# EAGLE schematic pm2017 (EAGLE 8.1.1)

## Sheet 1 of 2
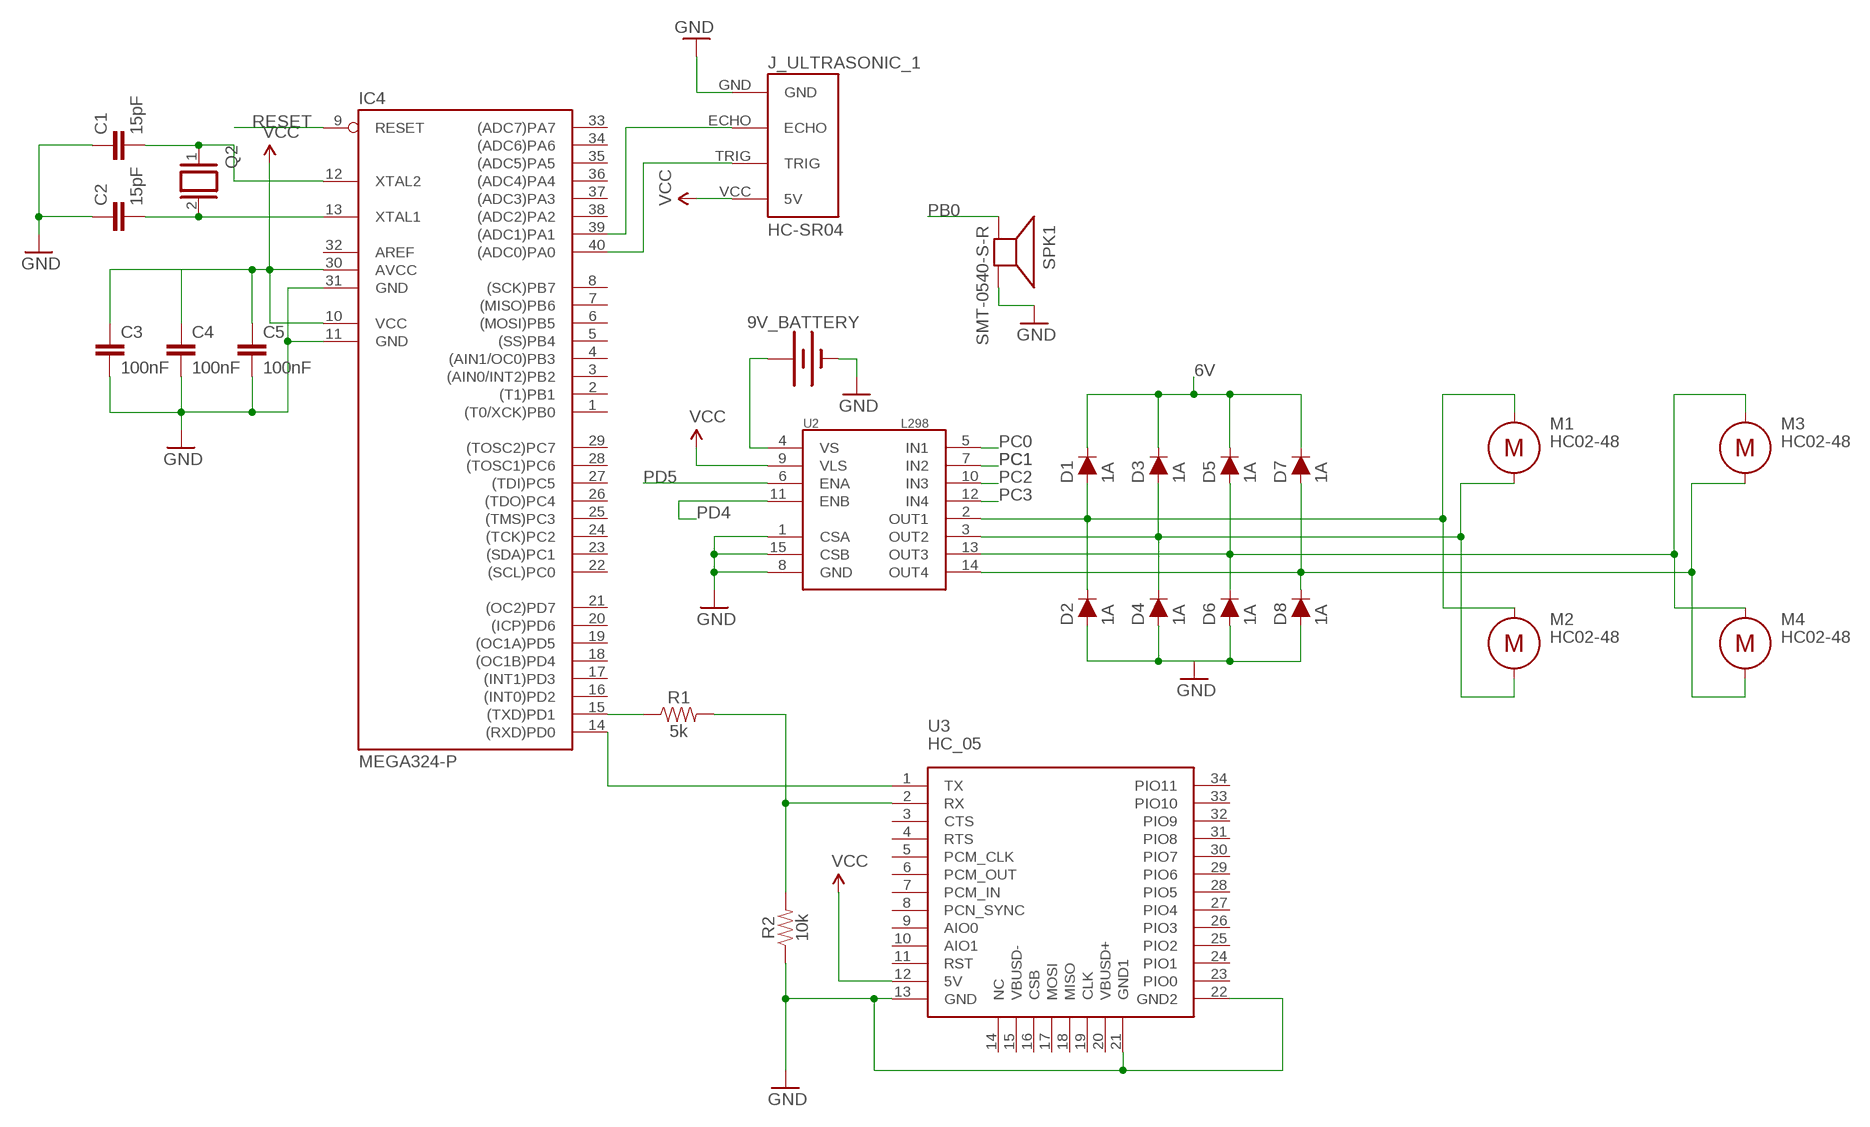
[diagram p0: schematic, sheet 1]

### Parts
9V_BATTERY  BATTERY-9V  [BATTCON_9V]
C1  15pF  C-EUC_PM  [C025-025X050]
C2  15pF  C-EUC_PM  [C025-025X050]
C3  100nF  C-EUC_PM  [C025-025X050]
C4  100nF  C-EUC_PM  [C025-025X050]
C5  100nF  C-EUC_PM  [C025-025X050]
D1  1A  DIODE-PTH  [DIODE-1N4001]
D2  1A  DIODE-PTH  [DIODE-1N4001]
D3  1A  DIODE-PTH  [DIODE-1N4001]
D4  1A  DIODE-PTH  [DIODE-1N4001]
D5  1A  DIODE-PTH  [DIODE-1N4001]
D6  1A  DIODE-PTH  [DIODE-1N4001]
D7  1A  DIODE-PTH  [DIODE-1N4001]
D8  1A  DIODE-PTH  [DIODE-1N4001]
IC4  MEGA324-P  MEGA16-P  [DIL40]
J_ULTRASONIC_1  HC-SR04  [HC-SR04_FOOTPRINT]
Q2  XTAL/S  [QS]
R1  5k  4.7KOHM-0603-1/10W-1%  [0603]
R2  10k  10KOHM-HORIZ-1/4W-1%  [AXIAL-0.3]
SPK1  SMT-0540-S-R  [SMT-0540-S-R]
U2  L298  [MULTIWATT15]
U3  HC_05  [BLUETOOTH_SMD]

### Nets
6V: D1.C D3.C D5.C D7.C
6V1: D1.A D2.C U2.2(OUT1)
GND: 9V_BATTERY.- C1.1 C2.1 C3.2 C4.2 C5.2 IC4.11(GND) IC4.31(GND) J_ULTRASONIC_1.GND R2.P$1 SPK1.+(-) U2.1(CSA) U2.8(GND) U2.15(CSB) U3.13(GND) U3.21(GND1) U3.22(GND2) ; also sheet 2
N$11: C3.1 IC4.30(AVCC)
N$12: C2.2 IC4.13(XTAL1) Q2.2
N$13: C1.2 IC4.12(XTAL2) Q2.1
N$16: IC4.40((ADC0)PA0) J_ULTRASONIC_1.TRIG
N$18: IC4.39((ADC1)PA1) J_ULTRASONIC_1.ECHO
N$24: D5.A D6.C U2.13(OUT3)
N$25: 9V_BATTERY.+ U2.4(VS)
N$26: D7.A D8.C U2.14(OUT4)
N$27: D3.A D4.C U2.3(OUT2)
N$28: IC4.14((RXD)PD0) U3.1(TX)
N$29: D2.A D4.A D6.A D8.A
N$30: IC4.15((TXD)PD1) R1.1
N$31: R1.2 R2.P$2 U3.2(RX)
PB0: SPK1.-(+)
PC0: U2.5(IN1) ; also sheet 2
PC1: U2.7(IN2) ; also sheet 2
PC2: U2.10(IN3)
PC3: U2.12(IN4)
PD4: U2.11(ENB)
PD5: U2.6(ENA)
RESET: IC4.9(RESET) ; also sheet 2
VCC: C4.1 C5.1 IC4.10(VCC) J_ULTRASONIC_1.VCC(5V) U2.9(VLS) U3.12(5V) ; also sheet 2
Unconnected: IC4.1((T0/XCK)PB0) IC4.2((T1)PB1) IC4.3((AIN0/INT2)PB2) IC4.4((AIN1/OC0)PB3) IC4.5((SS)PB4) IC4.6((MOSI)PB5) IC4.7((MISO)PB6) IC4.8((SCK)PB7) IC4.16((INT0)PD2) IC4.17((INT1)PD3) IC4.18((OC1B)PD4) IC4.19((OC1A)PD5) IC4.20((ICP)PD6) IC4.21((OC2)PD7) IC4.22((SCL)PC0) IC4.23((SDA)PC1) IC4.24((TCK)PC2) IC4.25((TMS)PC3) IC4.26((TDO)PC4) IC4.27((TDI)PC5) IC4.28((TOSC1)PC6) IC4.29((TOSC2)PC7) IC4.32(AREF) IC4.33((ADC7)PA7) IC4.34((ADC6)PA6) IC4.35((ADC5)PA5) IC4.36((ADC4)PA4) IC4.37((ADC3)PA3) IC4.38((ADC2)PA2) U3.3(CTS) U3.4(RTS) U3.5(PCM_CLK) U3.6(PCM_OUT) U3.7(PCM_IN) U3.8(PCN_SYNC) U3.9(AIO0) U3.10(AIO1) U3.11(RST) U3.14(NC) U3.15(VBUSD-) U3.16(CSB) U3.17(MOSI) U3.18(MISO) U3.19(CLK) U3.20(VBUSD+) U3.23(PIO0) U3.24(PIO1) U3.25(PIO2) U3.26(PIO3) U3.27(PIO4) U3.28(PIO5) U3.29(PIO6) U3.30(PIO7) U3.31(PIO8) U3.32(PIO9) U3.33(PIO10) U3.34(PIO11)

### Notes on the sheet
- M1 | M3
- M | HC02-48 | M | HC02-48
- M2 | M4
- M | HC02-48 | M | HC02-48

## Sheet 2 of 2
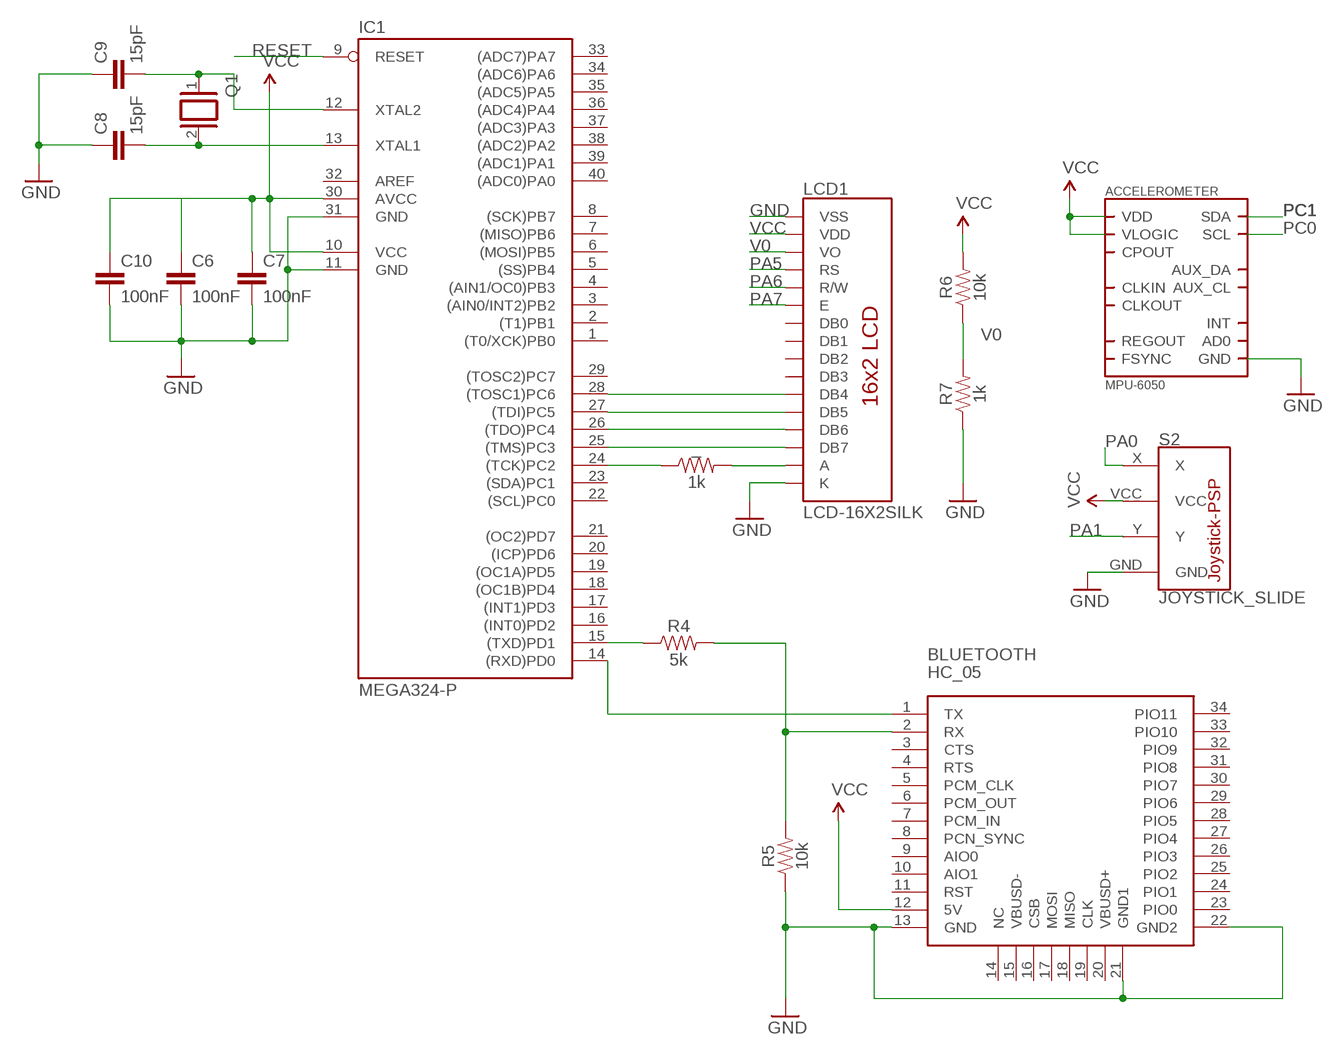
[diagram p1: schematic, sheet 2]

### Parts
_  1k  1KOHM-HORIZ-1/4W-5%  [AXIAL-0.3]
ACCELEROMETER  MPU-6050  [QFN.24.4X4]
BLUETOOTH  HC_05  [BLUETOOTH_SMD]
C6  100nF  C-EUC_PM  [C025-025X050]
C7  100nF  C-EUC_PM  [C025-025X050]
C8  15pF  C-EUC_PM  [C025-025X050]
C9  15pF  C-EUC_PM  [C025-025X050]
C10  100nF  C-EUC_PM  [C025-025X050]
IC1  MEGA324-P  MEGA16-P  [DIL40]
LCD1  LCD-16X2SILK  [LCD-16X2]
Q1  XTAL/S  [QS]
R4  5k  4.7KOHM-0603-1/10W-1%  [0603]
R5  10k  10KOHM-HORIZ-1/4W-1%  [AXIAL-0.3]
R6  10k  10KOHM-HORIZ-1/6W-5%  [AXIAL-0.3]
R7  1k  1KOHM-HORIZ-1/4W-5%  [AXIAL-0.3]
S2  JOYSTICK_SLIDE  [JOYSTICK-PSP1000]

### Nets
GND: ACCELEROMETER.18(GND) BLUETOOTH.13(GND) BLUETOOTH.21(GND1) BLUETOOTH.22(GND2) C6.2 C7.2 C8.1 C9.1 C10.2 IC1.11(GND) IC1.31(GND) LCD1.1(VSS) LCD1.16(K) R5.P$1 ; also sheet 1
N$1: C10.1 IC1.30(AVCC)
N$2: C8.2 IC1.13(XTAL1) Q1.2
N$3: C9.2 IC1.12(XTAL2) Q1.1
N$4: BLUETOOTH.1(TX) IC1.14((RXD)PD0)
N$5: BLUETOOTH.2(RX) R4.2 R5.P$2
N$6: IC1.15((TXD)PD1) R4.1
N$7: IC1.28((TOSC1)PC6) LCD1.11(DB4)
N$8: IC1.27((TDI)PC5) LCD1.12(DB5)
N$9: IC1.26((TDO)PC4) LCD1.13(DB6)
N$10: IC1.25((TMS)PC3) LCD1.14(DB7)
N$14: _.P$2 LCD1.15(A)
N$15: _.P$1 IC1.24((TCK)PC2)
N$17: R7.P$1
PA0: S2.X
PA1: S2.Y
PA5: LCD1.4(RS)
PA6: LCD1.5(R/W)
PA7: LCD1.6(E)
PC0: ACCELEROMETER.23(SCL) ; also sheet 1
PC1: ACCELEROMETER.24(SDA) ; also sheet 1
RESET: IC1.9(RESET) ; also sheet 1
V0: LCD1.3(VO) R6.P$1 R7.P$2
VCC: ACCELEROMETER.8(VLOGIC) ACCELEROMETER.13(VDD) BLUETOOTH.12(5V) C6.1 C7.1 IC1.10(VCC) LCD1.2(VDD) R6.P$2 ; also sheet 1
Unconnected: ACCELEROMETER.1(CLKIN) ACCELEROMETER.6(AUX_DA) ACCELEROMETER.7(AUX_CL) ACCELEROMETER.9(AD0) ACCELEROMETER.10(REGOUT) ACCELEROMETER.11(FSYNC) ACCELEROMETER.12(INT) ACCELEROMETER.20(CPOUT) ACCELEROMETER.22(CLKOUT) BLUETOOTH.3(CTS) BLUETOOTH.4(RTS) BLUETOOTH.5(PCM_CLK) BLUETOOTH.6(PCM_OUT) BLUETOOTH.7(PCM_IN) BLUETOOTH.8(PCN_SYNC) BLUETOOTH.9(AIO0) BLUETOOTH.10(AIO1) BLUETOOTH.11(RST) BLUETOOTH.14(NC) BLUETOOTH.15(VBUSD-) BLUETOOTH.16(CSB) BLUETOOTH.17(MOSI) BLUETOOTH.18(MISO) BLUETOOTH.19(CLK) BLUETOOTH.20(VBUSD+) BLUETOOTH.23(PIO0) BLUETOOTH.24(PIO1) BLUETOOTH.25(PIO2) BLUETOOTH.26(PIO3) BLUETOOTH.27(PIO4) BLUETOOTH.28(PIO5) BLUETOOTH.29(PIO6) BLUETOOTH.30(PIO7) BLUETOOTH.31(PIO8) BLUETOOTH.32(PIO9) BLUETOOTH.33(PIO10) BLUETOOTH.34(PIO11) IC1.1((T0/XCK)PB0) IC1.2((T1)PB1) IC1.3((AIN0/INT2)PB2) IC1.4((AIN1/OC0)PB3) IC1.5((SS)PB4) IC1.6((MOSI)PB5) IC1.7((MISO)PB6) IC1.8((SCK)PB7) IC1.16((INT0)PD2) IC1.17((INT1)PD3) IC1.18((OC1B)PD4) IC1.19((OC1A)PD5) IC1.20((ICP)PD6) IC1.21((OC2)PD7) IC1.22((SCL)PC0) IC1.23((SDA)PC1) IC1.29((TOSC2)PC7) IC1.32(AREF) IC1.33((ADC7)PA7) IC1.34((ADC6)PA6) IC1.35((ADC5)PA5) IC1.36((ADC4)PA4) IC1.37((ADC3)PA3) IC1.38((ADC2)PA2) IC1.39((ADC1)PA1) IC1.40((ADC0)PA0) LCD1.7(DB0) LCD1.8(DB1) LCD1.9(DB2) LCD1.10(DB3) S2.GND S2.VCC

## Library data of the parts
9V_BATTERY = SparkFun-Batteries:BATTERY: Battery - Single Cell A variety of battery chemistries, sizes, and footprints. Device List: 20MM_PTH - Coin Cell Battery Holder - 20mm (PTH) <https://www.sparkfun.com/products/783> 12MM_SMD - Coin Cell Battery Holder - 12mm (SMD) <https://www.sparkfun.com/products/10592> 12MM_PTH - Coin Cell Battery Holder - 12mm (PTH) <https://www.sparkfun.com/products/7948> 20MM_SMD - 20mm Coin Cell Battery Holder (SMD) (2 legs) Used on the Big Time Watch Kit <https://www.sparkfun.com/products/11734> 20MM_SMD_4LEGS - Coin Cell Battery Holder - 20mm (SMD) <https://www.sparkfun.com/products/11892> 20MM_SMD_4LEGS_OVERPASTE - Coin Cell Battery Holder - 20mm (SMD) <https://www.sparkfun.com/products/11892> (Over-paste on the legs) 24.5MM_PTH - Coin Cell Battery Holder - 24.5mm (PTH) <https://www.sparkfun.com/products/8863> 9V - 9V Battery Holder - PC Mount Used on the SparkFun SparkPunk Sound Kit <https://www.sparkfun.com/products/11177> and SparkFun SparkPunk Sequencer Kit <https://www.sparkfun.com/products/12707> 18650 - Battery Holder - 18650 (PTH) <https://www.sparkfun.com/products/13113> AA - Battery Holder - 1xAA (PTH) <https://www.sparkfun.com/products/7949> AAA - Battery Holder - 1xAAA (PTH) <https://www.sparkfun.com/products/12718> AA_KIT - Battery Holder - 1xAA (PTH) <https://www.sparkfun.com/products/7949> Special kit package - pads only have exposed copper on one side of the board. AAA_KIT - Battery Holder - 1xAAA (PTH) <https://www.sparkfun.com/products/12718> Special kit package - pads only have exposed copper on one side of the board.; PROD_ID: BATT-10855
_ R7 = SparkFun-Resistors:1KOHM: 1kΩ resistor A resistor is a passive two-terminal electrical component that implements electrical resistance as a circuit element. Resistors act to reduce current flow, and, at the same time, act to lower voltage levels within circuits. - Wikipedia; PROD_ID: RES-08380
ACCELEROMETER = invensense:MPU-6050
BLUETOOTH U3 = Bluetooth HC-05:HC_05: HC-05 Bluetooth Module
C1-C10 = 0andrei_custom:C-EU: CAPACITOR, European symbol
D1-D8 = SparkFun-DiscreteSemi:DIODE: Diode These are standard reverse protection diodes and small signal diodes. SparkFun Products: SparkFun SparkPunk Sound Kit <https://www.sparkfun.com/products/11177> SparkFun ESP8266 Thing <https://www.sparkfun.com/products/13231>; PROD_ID: DIO-09176; VALUE: 1A/50V/1.1V
IC1 IC4 = atmel:MEGA16-P: MICROCONTROLLER 16 Kbytes FLASH 1 kbytes SRAM 512 bytes EEPROM USART 8-channel 10 bit ADC Source: avr.lbr; MPN: ATMEGA16-16PU; OC_FARNELL: 9171142; OC_NEWARK: 01M6885
J_ULTRASONIC_1 = Ultrasonic Sensor HC-SR04:HC-SR04: Ultrasonic Sensor HC-SR04
LCD1 = SparkFun-Displays:LCD-16X2: Standard text-only 16x2 parallel input LCD Basic 16 character by 2 line display. Typically utilizes the extremely common HD44780 parallel interface chipset SparkFun Products: Basic 16x2 Green <https://www.sparkfun.com/products/255> Basic 8x2 Green <https://www.sparkfun.com/products/11122>; SF_ID: LCD-00255
Q1 Q2 = special:XTAL/S: CRYSTAL
R1 R4 = SparkFun-Resistors:4.7KOHM: 4.7kΩ resistor A resistor is a passive two-terminal electrical component that implements electrical resistance as a circuit element. Resistors act to reduce current flow, and, at the same time, act to lower voltage levels within circuits. - Wikipedia; PROD_ID: RES-07857; VALUE: 4.7k
R2 R5 = SparkFun-Resistors:10KOHM: 10kΩ resistor A resistor is a passive two-terminal electrical component that implements electrical resistance as a circuit element. Resistors act to reduce current flow, and, at the same time, act to lower voltage levels within circuits. - Wikipedia; PROD_ID: RES-12183
R6 = SparkFun-Resistors:10KOHM: 10kΩ resistor A resistor is a passive two-terminal electrical component that implements electrical resistance as a circuit element. Resistors act to reduce current flow, and, at the same time, act to lower voltage levels within circuits. - Wikipedia; PROD_ID: RES-08375
S2 = SparkFun-Switches:JOYSTICK_SLIDE: Resistive Thumb Slide Joystick This is a resistive analog joystick, very similar to those found on the PSP1000. These compact joysticks are different in that they have a very interesting ‘slide’ feeling. SparkFun Products Thumb Slide Joystick <https://www.sparkfun.com/products/9426> (COM-09426); SF_SKU: COM-09426
SPK1 = adafruit:SMT-0540-S-R: SMT-0549-S-R Small surface-mount magnetic buzzer
U2 = SparkFun-IC-Special-Function:L298: L298 Dual Full Bridge Driver

## Net classes
1 power: width 0.61 mm